# Altium schematic sheet Sheet1.SchDoc
size B
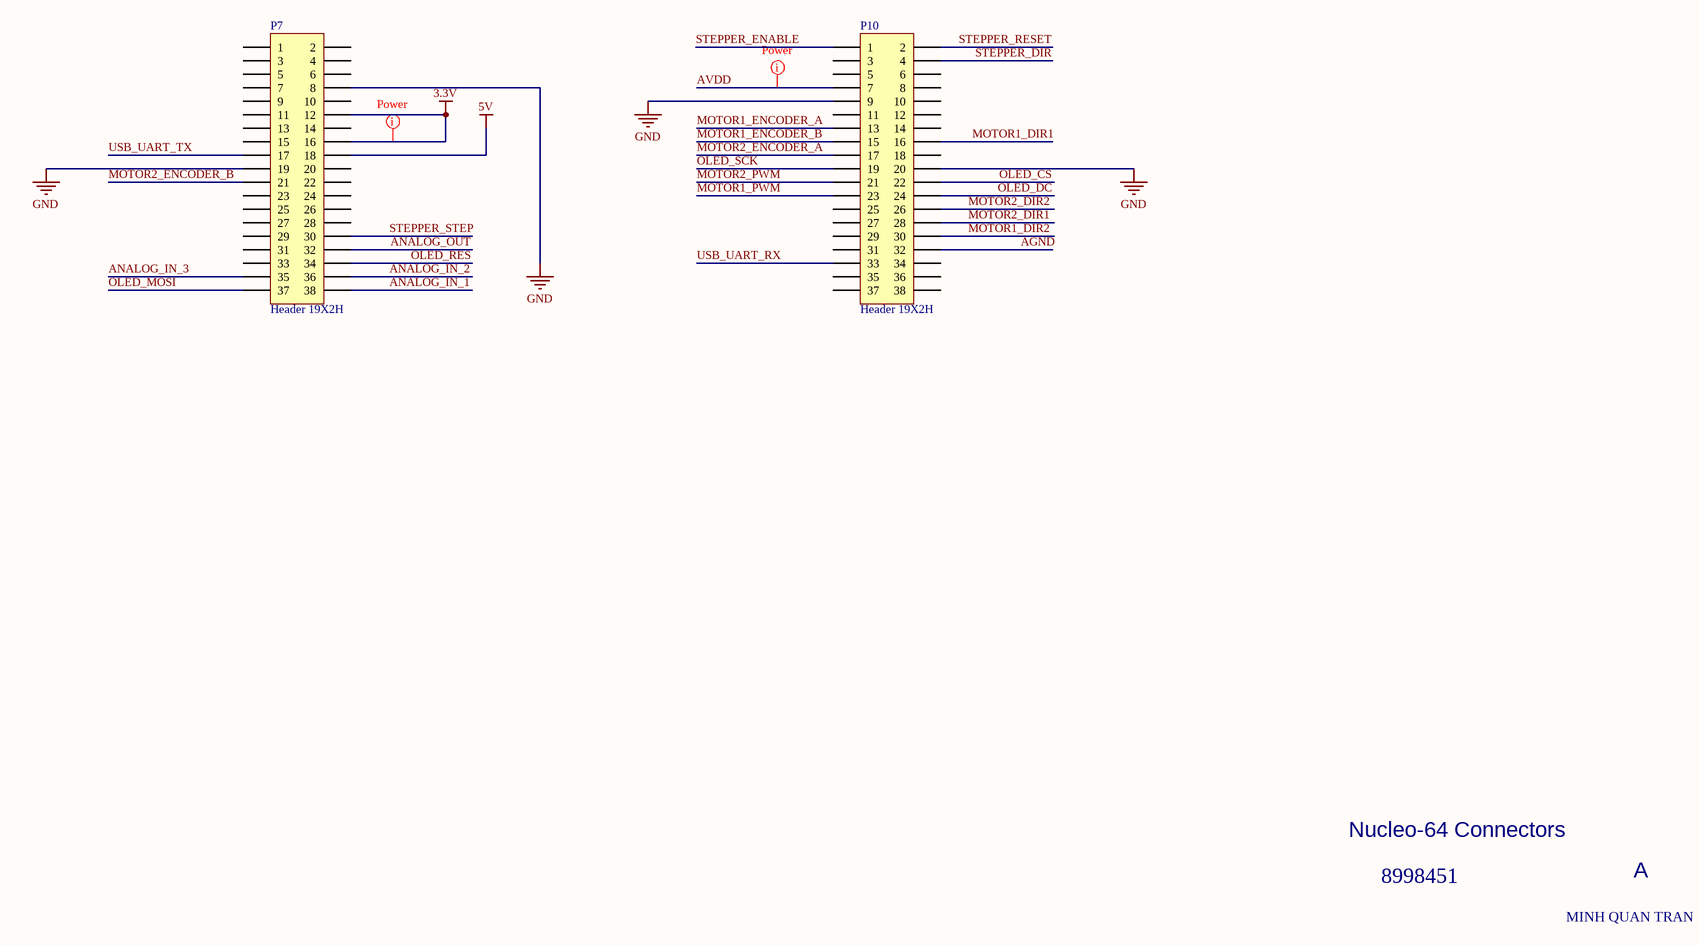
[diagram p0: Sheet1.SchDoc]

## Parts
P7  Header 19X2H  [PPPC192LFBN-RC]
P10  Header 19X2H  [PPPC192LFBN-RC]

## Nets
3.3V: P7.12 P7.16
5V: P7.18
GND: P7.8 P7.19 P10.9 P10.20
AGND: P10.32
ANALOG_IN_1: P7.38
ANALOG_IN_2: P7.36
ANALOG_IN_3: P7.35
ANALOG_OUT: P7.32
AVDD: P10.7
MOTOR1_DIR1: P10.16
MOTOR1_DIR2: P10.30
MOTOR1_ENCODER_A: P10.13
MOTOR1_ENCODER_B: P10.15
MOTOR1_PWM: P10.23
MOTOR2_DIR1: P10.28
MOTOR2_DIR2: P10.26
MOTOR2_ENCODER_A: P10.17
MOTOR2_ENCODER_B: P7.21
MOTOR2_PWM: P10.21
OLED_CS: P10.22
OLED_DC: P10.24
OLED_MOSI: P7.37
OLED_RES: P7.34
OLED_SCK: P10.19
STEPPER_DIR: P10.4
STEPPER_ENABLE: P10.1
STEPPER_RESET: P10.2
STEPPER_STEP: P7.30
USB_UART_RX: P10.33
USB_UART_TX: P7.17

Not connected (* = marked no-connect by the designer): P7 1 2 3 4 5 6 7 9 10 11 13 14 15 20 22 23 24 25 26 27 28 29 31 33; P10 3 5 6 8 10 11 12 14 18 25 27 29 31 34 35 36 37 38

## Layout directives
rule Width Constraint [Pref Width = 30mil    Min Width = 10mil    Max Width = 30mil]: 3.3V, AVDD

## Notes on the sheet
- Nucleo-64 Connectors
- 8998451
- A
- MINH QUAN TRAN

## Library data of the parts
P7 P10 = Header 19X2H: 38 Position Header Connector 0.100in (2.54mm) Through Hole Gold; PN: S7122-ND; URL: https://www.digikey.ca/product-detail/en/sullins-connector-solutions/PPPC192LFBN-RC/S7122-ND; MPN: PPPC192LFBN-RC